# Altium project conn_board.PrjPcb (part 3 of 3)
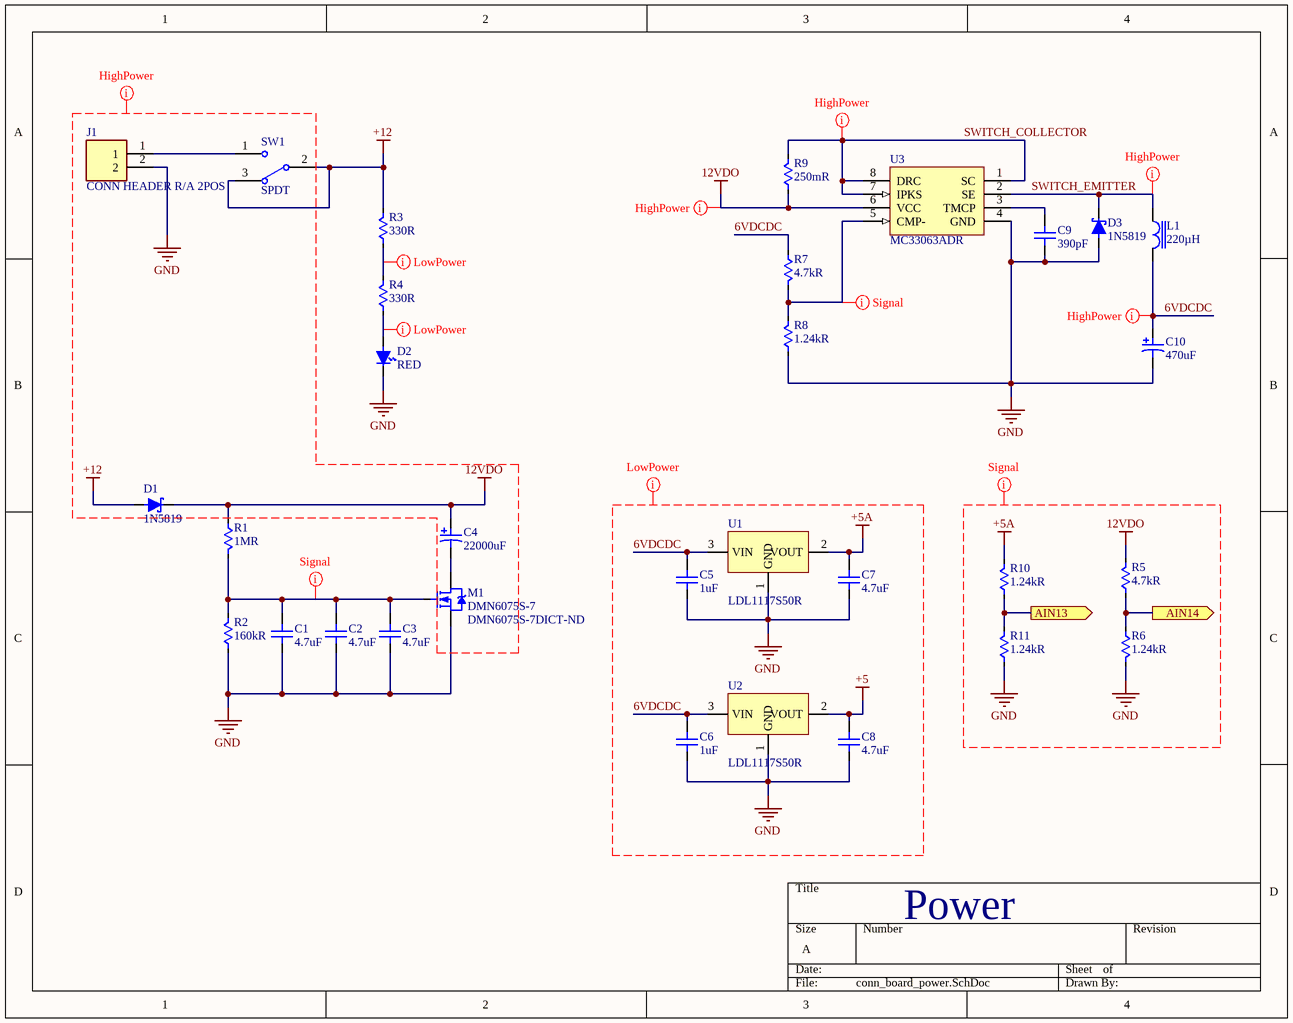
[diagram p4: conn_board_power.SchDoc]

## Sheet conn_board_power.SchDoc (continued)

### Library data of the parts (continued)
U3 = MC33063ADR: 1.5-A peak boost/buck/inverting switching regulator 8-SOIC -40 to 85; Manufacturer: Texas Instruments; Number of Outputs: 1; Output Current: 1.5A; Output Voltage: 40V; Switching Frequency: 100kHz; Min Input Voltage: 3V; Synchronous Rectifier: No; Output Type: Adjustable; Max Output Current: 750mA; Min Output Voltage: 1.25V; Quiescent Current: 4mA; Topology: Flyback; Supplier 1: Digi-Key; Manufacturer Part Number: MC33063ADR; Category: IC; Stock 1: 130093; Pricing 1: 1=0.44000, 10=0.37500, 25=0.35000, 100=0.26000, 250=0.22000, 500=0.21000, 1000=0.15500 (USD); Case/Package: D; Number of Pins: 8; Weight: 0.002561oz; Contact Plating: Gold; Min Operating Temperature: -40°C; Max Operating Temperature: 85°C; Packaging: Tape and Reel; Package Quantity: 1; Max Input Voltage: 40V; Max Output Voltage: 40V; Termination: SMD/SMT; Lead Free: Lead Free; REACH SVHC: No SVHC; ComponentLink1URL: https://datasheet.ciiva.com/41462/001014422-da-01-en-ic-reg-buck-boost-mc33063adr-soic-8-tid-41462284.pdf?src-supplier=Conrad; ComponentLink1Description: https://datasheet.ciiva.com/41462/001014422-da-01-en-ic-reg-buck-boost-mc33063adr-soic-8-tid-41462284.pdf?src-supplier=Conrad; ComponentLink2URL: https://datasheet.ciiva.com/26897/mc33063adr-26897702.pdf?src-supplier=IIIC; ComponentLink2Description: https://datasheet.ciiva.com/26897/mc33063adr-26897702.pdf?src-supplier=IIIC; ComponentLink3URL: https://datasheet.ciiva.com/7993/1862376-7993641.pdf?src-supplier=Element14; ComponentLink3Description: https://datasheet.ciiva.com/7993/1862376-7993641.pdf?src-supplier=Element14; ComponentLink4URL: https://datasheet.ciiva.com/7408/1862376-7408058.pdf?src-supplier=Newark; ComponentLink4Description: https://datasheet.ciiva.com/7408/1862376-7408058.pdf?src-supplier=Newark; ComponentLink5URL: https://datasheet.ciiva.com/46419/1803417-46419179.pdf?src-supplier=Element14; ComponentLink5Description: https://datasheet.ciiva.com/46419/1803417-46419179.pdf?src-supplier=Element14; ComponentLink6URL: https://datasheet.ciiva.com/2025/mc33063a-2025164.pdf?src-supplier=Digi-Key; ComponentLink6Description: https://datasheet.ciiva.com/2025/mc33063a-2025164.pdf?src-supplier=Digi-Key; ComponentLink7URL: https://datasheet.ciiva.com/2025/mc33063a-2025165.pdf?src-supplier=Digi-Key; ComponentLink7Description: https://datasheet.ciiva.com/2025/mc33063a-2025165.pdf?src-supplier=Digi-Key; ComponentLink8URL: https://datasheet.ciiva.com/2025/mc33063a-2025166.pdf?src-supplier=Digi-Key; ComponentLink8Description: https://datasheet.ciiva.com/2025/mc33063a-2025166.pdf?src-supplier=Digi-Key; ComponentLink9URL: https://octopart.com/click/track?ai=8629&ct=datasheets&sig=0128011&at=physicalpart&sid=370&ppid=525094&hlid=24898548&src-supplier=TI+store; ComponentLink9Description: https://octopart.com/click/track?ai=8629&ct=datasheets&sig=0128011&at=physicalpart&sid=370&ppid=525094&hlid=24898548&src-supplier=TI+store; ComponentLink10URL: http://datasheet.octopart.com/MC33063ADR-Texas-Instruments-datasheet-37140769.pdf?src-supplier=Farnell; ComponentLink10Description: http://datasheet.octopart.com/MC33063ADR-Texas-Instruments-datasheet-37140769.pdf?src-supplier=Farnell; ComponentLink11URL: http://datasheet.octopart.com/MC33063ADR-Texas-Instruments-datasheet-149237.pdf?src-supplier=TI+store; ComponentLink11Description: http://datasheet.octopart.com/MC33063ADR-Texas-Instruments-datasheet-149237.pdf?src-supplier=TI+store; ComponentLink12URL: http://datasheet.octopart.com/MC33063ADR-Texas-Instruments-datasheet-149238.pdf?src-supplier=TI+store; ComponentLink12Description: http://datasheet.octopart.com/MC33063ADR-Texas-Instruments-datasheet-149238.pdf?src-supplier=TI+store; ComponentLink13URL: http://datasheet.octopart.com/MC33063ADR-Texas-Instruments-datasheet-149239.pdf?src-supplier=TI+store; ComponentLink13Description: http://datasheet.octopart.com/MC33063ADR-Texas-Instruments-datasheet-149239.pdf?src-supplier=TI+store; ComponentLink14URL: http://datasheet.octopart.com/MC33063ADR-Texas-Instruments-datasheet-149240.pdf?src-supplier=TI+store; ComponentLink14Description: http://datasheet.octopart.com/MC33063ADR-Texas-Instruments-datasheet-149240.pdf?src-supplier=TI+store; ComponentLink15URL: http://datasheet.octopart.com/MC33063ADR-Texas-Instruments-datasheet-149241.pdf?src-supplier=TI+store; ComponentLink15Description: http://datasheet.octopart.com/MC33063ADR-Texas-Instruments-datasheet-149241.pdf?src-supplier=TI+store; ComponentLink16URL: http://datasheet.octopart.com/MC33063ADR-Texas-Instruments-datasheet-10254267.pdf?src-supplier=TI+store; ComponentLink16Description: http://datasheet.octopart.com/MC33063ADR-Texas-Instruments-datasheet-10254267.pdf?src-supplier=TI+store; ComponentLink17URL: http://sigma.octopart.com/49249642/technical_drawing/Texas-Instruments-MC33063ADR.pdf?src-supplier=TI+store; ComponentLink17Description: http://sigma.octopart.com/49249642/technical_drawing/Texas-Instruments-MC33063ADR.pdf?src-supplier=TI+store; ComponentLink18URL: http://datasheet.octopart.com/MC33063ADR-Texas-Instruments-datasheet-12606816.pdf?src-supplier=Farnell; ComponentLink18Description: http://datasheet.octopart.com/MC33063ADR-Texas-Instruments-datasheet-12606816.pdf?src-supplier=Farnell; ComponentLink19URL: http://datasheet.octopart.com/MC33063ADR-Texas-Instruments-datasheet-81639027.pdf?src-supplier=Farnell; ComponentLink19Description: http://datasheet.octopart.com/MC33063ADR-Texas-Instruments-datasheet-81639027.pdf?src-supplier=Farnell; ComponentLink20URL: http://datasheet.octopart.com/MC33063ADR-Texas-Instruments-datasheet-23714746.pdf?src-supplier=Newark; ComponentLink20Description: http://datasheet.octopart.com/MC33063ADR-Texas-Instruments-datasheet-23714746.pdf?src-supplier=Newark; ComponentLink21URL: http://datasheet.octopart.com/MC33063ADR-Texas-Instruments-datasheet-33038661.pdf?src-supplier=Element14; ComponentLink21Description: http://datasheet.octopart.com/MC33063ADR-Texas-Instruments-datasheet-33038661.pdf?src-supplier=Element14; ComponentLink22URL: http://datasheet.octopart.com/MC33063ADR.-Texas-Instruments-datasheet-58444985.pdf?src-supplier=Element14; ComponentLink22Description: http://datasheet.octopart.com/MC33063ADR.-Texas-Instruments-datasheet-58444985.pdf?src-supplier=Element14; ComponentLink23URL: http://datasheet.octopart.com/MC33063ADR.-Texas-Instruments-datasheet-65572232.pdf?src-supplier=Element14; ComponentLink23Description: http://datasheet.octopart.com/MC33063ADR.-Texas-Instruments-datasheet-65572232.pdf?src-supplier=Element14; ComponentLink24URL: http://datasheet.octopart.com/MC33063ADR-Texas-Instruments-datasheet-12052.pdf?src-supplier=Newark; ComponentLink24Description: http://datasheet.octopart.com/MC33063ADR-Texas-Instruments-datasheet-12052.pdf?src-supplier=Newark; ComponentLink25URL: http://datasheet.octopart.com/MC33063ADR-Texas-Instruments-datasheet-137654.pdf?src-supplier=Digi-Key; ComponentLink25Description: http://datasheet.octopart.com/MC33063ADR-Texas-Instruments-datasheet-137654.pdf?src-supplier=Digi-Key; ComponentLink26URL: http://datasheet.octopart.com/MC33063ADR-Texas-Instruments-datasheet-8883959.pdf?src-supplier=Element14; ComponentLink26Description: http://datasheet.octopart.com/MC33063ADR-Texas-Instruments-datasheet-8883959.pdf?src-supplier=Element14; ComponentLink27URL: http://datasheet.octopart.com/MC33063ADR-Texas-Instruments-datasheet-11768196.pdf?src-supplier=Arrow; ComponentLink27Description: http://datasheet.octopart.com/MC33063ADR-Texas-Instruments-datasheet-11768196.pdf?src-supplier=Arrow; ComponentLink28URL: http://datasheet.octopart.com/MC33063ADR-Texas-Instruments-datasheet-14045796.pdf?src-supplier=IIIC; ComponentLink28Description: http://datasheet.octopart.com/MC33063ADR-Texas-Instruments-datasheet-14045796.pdf?src-supplier=IIIC; Supplier Part Number 1: 296-17763-1-ND

## Nets that join several sheets
12VDO: conn_board_adc (C26.2 JP1.1 JP1.2 U5.2), conn_board_interfaces (D5.1 S2.1), conn_board_power (6 pins)
+5: conn_board_interfaces (20 pins), conn_board_power (C8.2 U2.2)
+5A: conn_board_adc (C23.1 U4.19), conn_board_interfaces (J5.1), conn_board_power (C7.2 R10.2 U1.2)
GND: conn_board_adc (24 pins), conn_board_interfaces (7 pins), conn_board_power (20 pins)
AIN0: conn_board_adc (R33.1), conn_board_interfaces (J2.8)
AIN1: conn_board_adc (R34.1), conn_board_interfaces (J2.7)
AIN2: conn_board_adc (R35.1), conn_board_interfaces (J2.6)
AIN3: conn_board_adc (R36.1), conn_board_interfaces (J2.5)
AIN4: conn_board_adc (R37.1), conn_board_interfaces (J2.4)
AIN5: conn_board_adc (R38.1), conn_board_interfaces (J2.3)
AIN6: conn_board_adc (R39.1), conn_board_interfaces (J2.2)
AIN7: conn_board_adc (R40.1), conn_board_interfaces (J2.1)
AIN8: conn_board_adc (R41.1), conn_board_interfaces (J3.8)
AIN9: conn_board_adc (R42.1), conn_board_interfaces (J3.7)
AIN10: conn_board_adc (R43.1), conn_board_interfaces (J3.6)
NetP3_6: conn_board_adc (U4.16), conn_board_interfaces (P3.6 R49.5)
NetP3_7: conn_board_adc (U4.20), conn_board_interfaces (P3.7 R49.7)
NetP3_8: conn_board_adc (U4.21), conn_board_interfaces (P3.8 R51.1)
NetP3_9: conn_board_adc (U4.22), conn_board_interfaces (P3.9 R51.3)
NetP3_10: conn_board_adc (U4.23), conn_board_interfaces (P3.10 R51.5)
NetP3_11: conn_board_adc (U4.24), conn_board_interfaces (P3.11 R51.7)
NetR5_1: conn_board_adc (R45.1), conn_board_power (R5.1 R6.1)
NetR10_1: conn_board_adc (R44.1), conn_board_power (R10.1 R11.2)